# Altium schematic sheet 5V_Regulator.SchDoc
size A; SheetNumber: 2; SheetTotal: 4
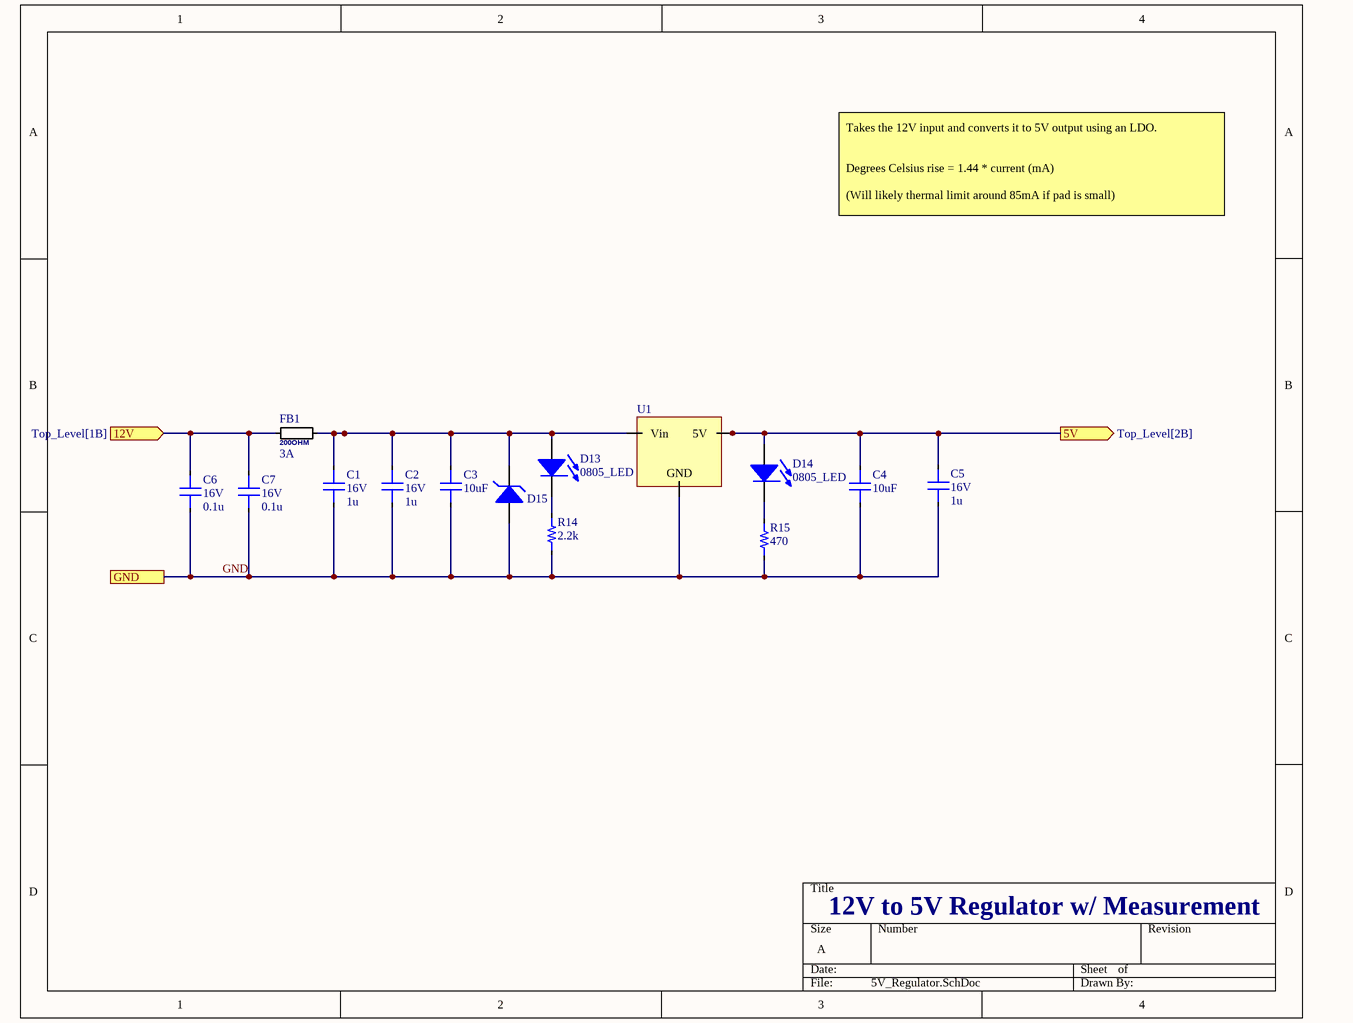
[diagram p0: 5V_Regulator.SchDoc]

## Parts
C1  value 1u  Voltage: 16V  [0603_CAP]  (hidden comment: Capacitor)
C2  value 1u  Voltage: 16V  [0603_CAP]  (hidden comment: Capacitor)
C3  value 10uF  [0603_CAP]  (hidden comment: Capacitor)
C4  value 10uF  [0603_CAP]  (hidden comment: Capacitor)
C5  value 1u  Voltage: 16V  [0603_CAP]  (hidden comment: Capacitor)
C6  value 0.1u  Voltage: 16V  [0603_CAP]  (hidden comment: Capacitor)
C7  value 0.1u  Voltage: 16V  [0603_CAP]  (hidden comment: Capacitor)
D13  0805_LED  [0805_LED]
D14  0805_LED  [0805_LED]
D15  DDZ9701  [SOD-123]  (value not drawn)
FB1  =Z@100MHz: 200OHM  iMax: 3A  [0805_Ferrite]  (hidden comment: *)
R14  value 2.2k  [0603_RES]  (hidden comment: Resistor)
R15  value 470  [0603_RES]  (hidden comment: Resistor)
U1  NCP1117ST50T3G  [SOT-233-4]  (value not drawn)

## Ports
5V (out, see Top_Level[2B]), 12V (in, see Top_Level[1B]), GND

## Nets
5V: C4.2 C5.2 D14.1(A) U1.2(5V) U1.4(Tab) ; port 5V
12V: C6.2 C7.2 FB1.1 ; port 12V
GND: C1.1 C2.1 C3.1 C4.1 C5.1 C6.1 C7.1 D15.2(A) R14.1 R15.1 U1.1(GND) ; port GND
NetC1_2: C1.2 C2.2 C3.2 D13.1(A) D15.1(K) FB1.2 U1.3(Vin)
NetD13_2: D13.2(K) R14.2
NetD14_2: D14.2(K) R15.2

## Notes on the sheet
- Takes the 12V input and converts it to 5V output using an LDO.
  Degrees Celsius rise = 1.44 * current (mA)
  (Will likely thermal limit around 85mA if pad is small)
- 12V to 5V Regulator w/ Measurement
- Title
- Size:
- Date:
- A
- Number:
- Time:
- Revision:
- Sheet
- of
- File:

## Library data of the parts
D13 D14 = 0805_LED: Generic 0805 LED
D15 = DDZ9701: Zener Diode 14V 500mW ±5% Surface Mount SOD-1; Vr: 10.6; Num_Circuits: 1; Package: SOD-123; ComponentLink1Description: Digikey; ComponentLink1URL: https://www.digikey.com/product-detail/en/diodes-incorporated/DDZ9701-7/DDZ9701-7DICT-ND/3877402
FB1 = ChipFerrite: Link: *; MfrPartNo: *; Name: *; Resistance: *; Package: *; Inductance: *
U1 = NCP1117ST50T3G: Vout: 5; Name: NCP1117ST50T3G; Type: Linear fixed; ComponentLink1Description: Digikey; ComponentLink1URL: https://www.digikey.com/product-detail/en/on-semiconductor/NCP1117ST50T3G/NCP1117ST50T3GOSCT-ND/1967217; ComponentLink2Description: Datasheet; ComponentLink2URL: https://www.onsemi.com/pub/Collateral/NCP1117-D.PDF
C1-C7 = Capacitor: Dielectric: *; Percent Tolerance: *; ESR: *
R14 R15 = Resistor: Tolerance: *